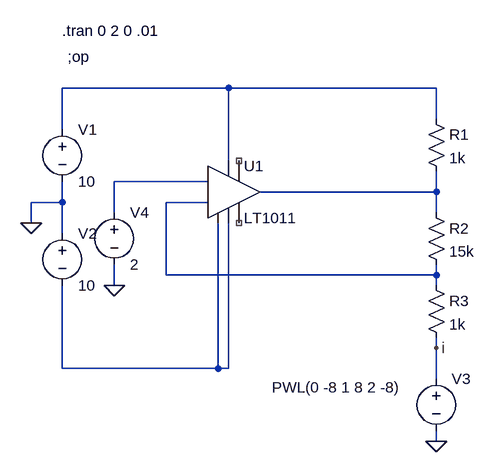
[diagram p0: schematic comparadorLt1011_7.asc]
comparadorLt1011_7.asc, the LTspice schematic file:
Version 4
SHEET 1 1044 680
WIRE 192 0 -64 0
WIRE 512 0 192 0
WIRE 512 48 512 0
WIRE -64 64 -64 0
WIRE 192 112 192 0
WIRE 160 144 16 144
WIRE 512 160 512 128
WIRE 512 160 240 160
WIRE -64 176 -64 144
WIRE -64 176 -112 176
WIRE 160 176 96 176
WIRE 16 192 16 144
WIRE 512 192 512 160
WIRE -112 208 -112 176
WIRE -64 224 -64 176
WIRE 96 288 96 176
WIRE 512 288 512 272
WIRE 512 288 96 288
WIRE 16 304 16 272
WIRE 512 304 512 288
WIRE 512 400 512 384
WIRE -64 432 -64 304
WIRE 176 432 176 208
WIRE 176 432 -64 432
WIRE 192 432 192 208
WIRE 192 432 176 432
WIRE 512 448 512 400
WIRE 512 544 512 528
FLAG -112 208 0
FLAG 512 544 0
FLAG 16 304 0
FLAG 512 400 i
SYMBOL Comparators\\LT1011 192 160 R0
SYMATTR InstName U1
SYMBOL voltage -64 48 R0
WINDOW 123 0 0 Left 0
WINDOW 39 0 0 Left 0
SYMATTR InstName V1
SYMATTR Value 10
SYMBOL voltage -64 208 R0
WINDOW 123 0 0 Left 0
WINDOW 39 0 0 Left 0
SYMATTR InstName V2
SYMATTR Value 10
SYMBOL res 496 32 R0
SYMATTR InstName R1
SYMATTR Value 1k
SYMBOL res 496 176 R0
SYMATTR InstName R2
SYMATTR Value 15k
SYMBOL res 496 288 R0
SYMATTR InstName R3
SYMATTR Value 1k
SYMBOL voltage 512 432 R0
WINDOW 3 -253 29 Left 2
WINDOW 123 0 0 Left 0
WINDOW 39 0 0 Left 0
SYMATTR Value PWL(0 -8 1 8 2 -8)
SYMATTR InstName V3
SYMBOL voltage 16 176 R0
WINDOW 123 0 0 Left 0
WINDOW 39 0 0 Left 0
SYMATTR InstName V4
SYMATTR Value 2
TEXT -56 -48 Left 2 !;op
TEXT -64 -88 Left 2 !.tran 0 2 0 .01

The netlist it stands for:
* comparadorLt1011_7.asc
XU1 N005 N004 N002 N005 NC_01 NC_02 N003 N001 LT1011
V1 N001 0 10
V2 0 N005 10
R1 N001 N003 1k
R2 N003 N004 15k
R3 N004 i 1k
V3 i 0 PWL(0 -8 1 8 2 -8)
V4 N002 0 2
;op
.tran 0 2 0 .01
.lib LTC1.lib
.backanno
.end